# EAGLE design HB-power_v1.1 (EAGLE 9.4.2)
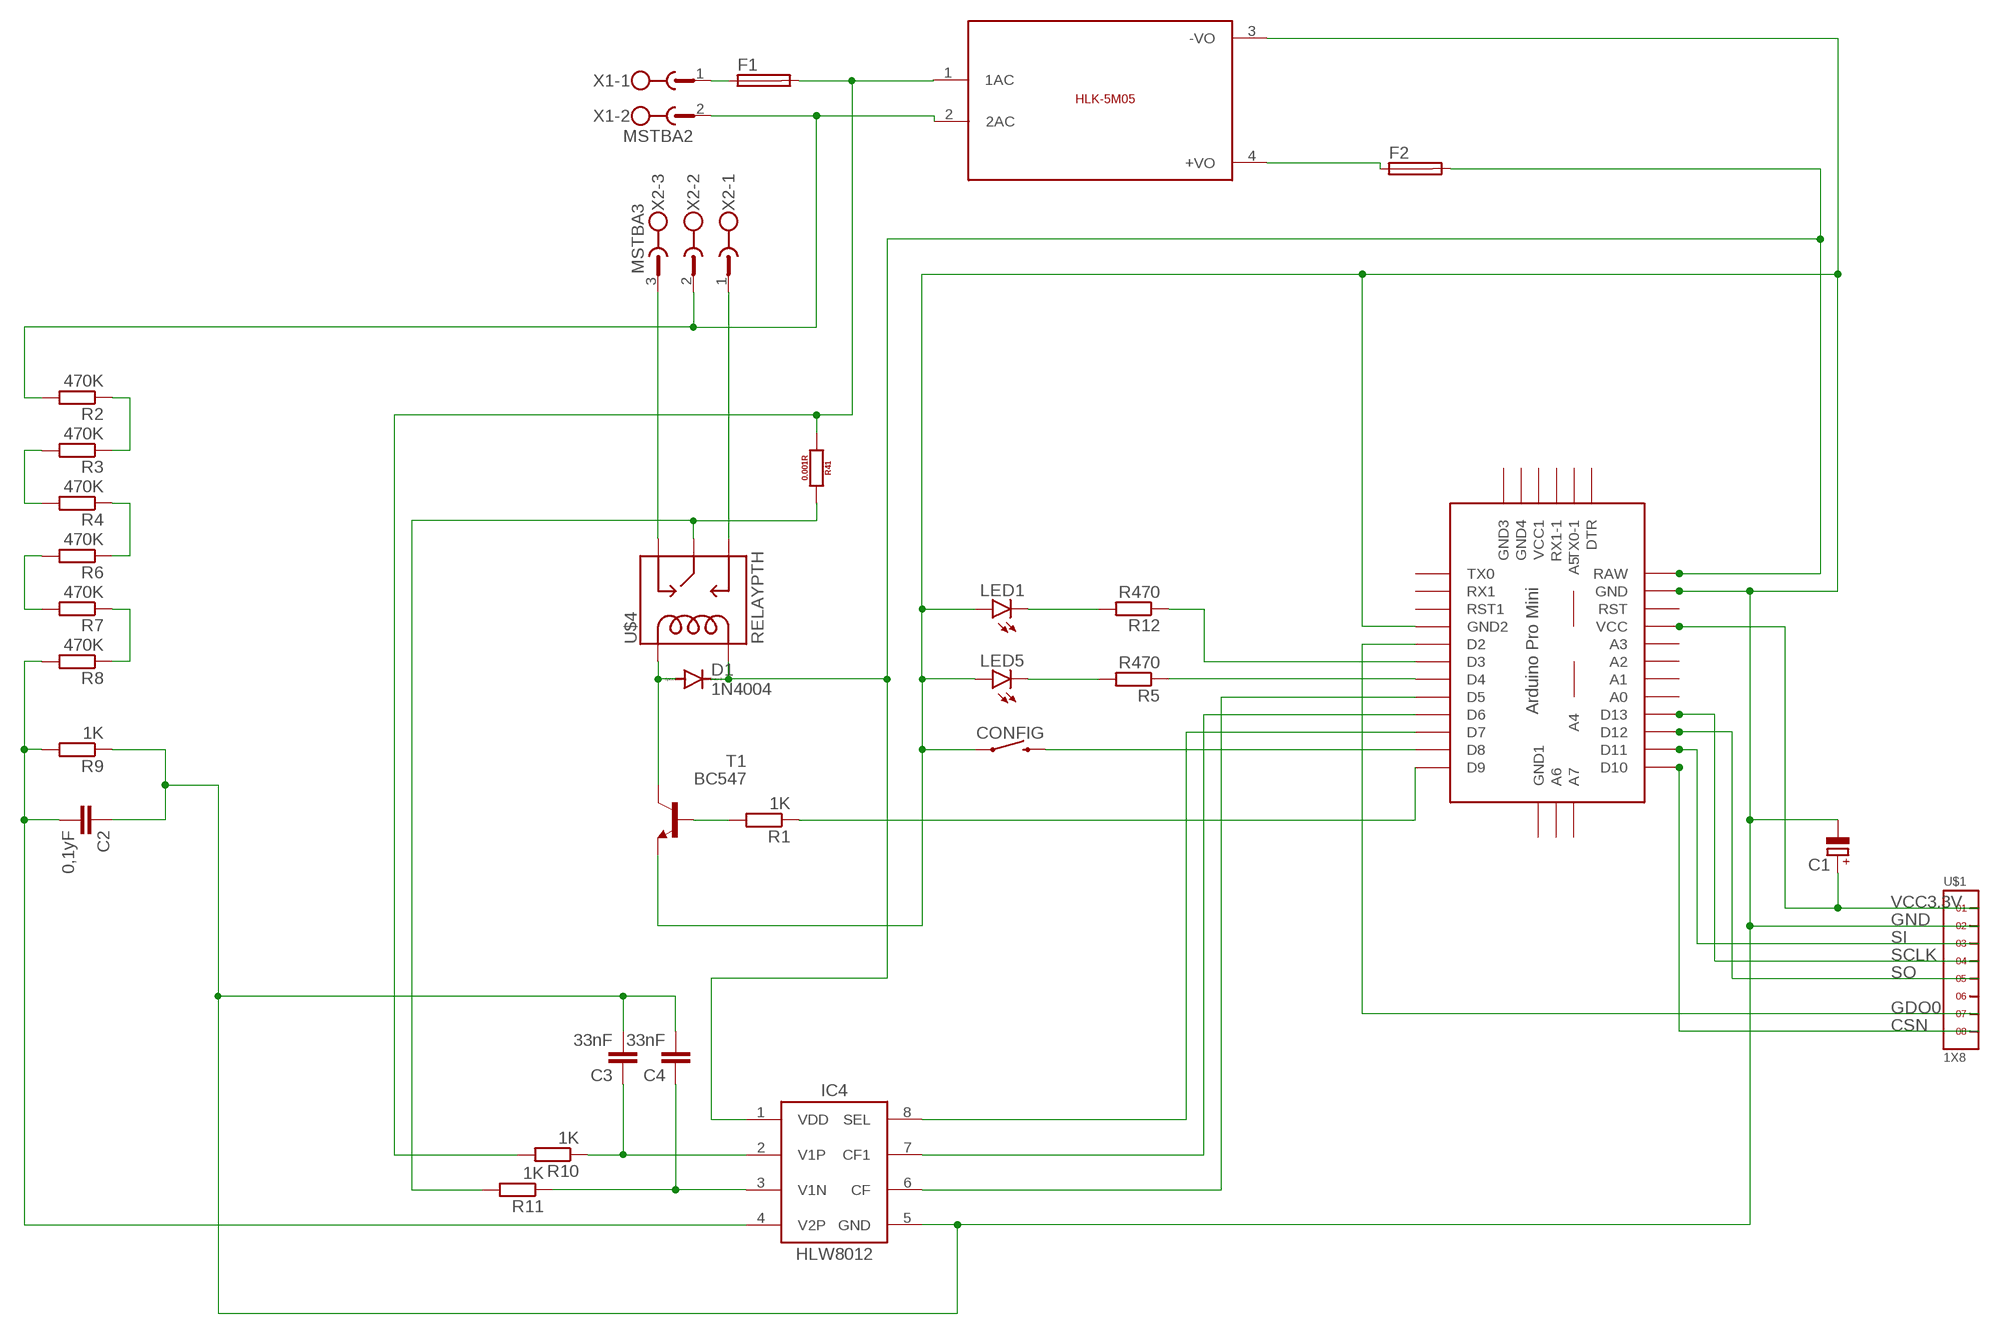
[diagram p0: schematic, sheet 1]

## Parts
C1  CPOL-EUE2.5-5  [E2,5-5]
C2  0,1yF  C-EU050-024X044  [C050-024X044]
C3  33nF  C-EU050-024X044  [C050-024X044]
C4  33nF  C-EU050-024X044  [C050-024X044]
CONFIG  MOMENTARY-SWITCH-SPST-PTH-6.0MM-KIT  [TACTILE_SWITCH_PTH_6.0MM_KIT]
D1  1N4004  [DO41-10]
F1  SH22,5A  [SH22,5A]
F2  SH22,5A  [SH22,5A]
IC4  HLW8012  [SOP8]
LED1  LED3MM  [LED3MM]
LED5  LED3MM  [LED3MM]
R1  1K  R-EU_0309/10  [0309/10]
R2  470K  R-EU_0309/10  [0309/10]
R3  470K  R-EU_0309/10  [0309/10]
R4  470K  R-EU_0309/10  [0309/10]
R5  R470  R-EU_0309/10  [0309/10]
R6  470K  R-EU_0309/10  [0309/10]
R7  470K  R-EU_0309/10  [0309/10]
R8  470K  R-EU_0309/10  [0309/10]
R9  1K  R-EU_0309/10  [0309/10]
R10  1K  R-EU_0309/10  [0309/10]
R11  1K  R-EU_0309/10  [0309/10]
R12  R470  R-EU_0309/10  [0309/10]
R41  0.001R  RESISTOR2512  [2512]
T1  BC547  [TO92]
U$1  1X8  [1X8]
U$2  ABK-PRO-MINI  [ABK-PRO-MINI]
U$3  5VDC/5W  HLK-5M05  [HLK-5M05]
U$4  RELAYPTH  [SRD-05VDC-SL-C]
X1  MSTBA2  [MSTBA2]
X2  MSTBA3  [MSTBA3]

## Nets
CSN: U$1.8 U$2.D10
GDO0: U$1.7 U$2.D2
GND: C1.- C2.1 C3.2 C4.2 CONFIG.1 IC4.5(GND) LED1.A LED5.A R9.1 T1.1(E) U$1.2 U$2.GND U$2.GND1(GND2) U$3.3(-VO)
L: F1.1 X1.1
L1: F1.2 R10.2 R41.1 U$3.1(1AC)
L2: R11.2 R41.2 U$4.SWCOMMON
N: R2.2 U$3.2(2AC) X1.2 X2.2
N$1: D1.A T1.3(C) U$4.COIL1
N$2: R1.2 T1.2(B)
N$3: LED1.K(C) R12.2
N$4: R1.1 U$2.D9
N$5: R12.1 U$2.D3
N$6: IC4.8(SEL) U$2.D7
N$7: IC4.7(CF1) U$2.D6
N$8: IC4.6(CF) U$2.D5
N$10: F2.1 U$3.4(+VO)
N$11: U$4.SWCLOSED(SWCLOSE) X2.3
N$12: U$4.SWOPEN X2.1
N$13: R2.1 R3.1
N$14: R4.1 R6.1
N$15: R7.1 R8.1
N$16: CONFIG.3 U$2.D8
N$17: R5.1 U$2.D4
N$18: LED5.K(C) R5.2
N$19: R3.2 R4.2
N$20: R6.2 R7.2
N$21: C2.2 IC4.4(V2P) R8.2 R9.2
N$23: C3.1 IC4.2(V1P) R10.1
N$25: C4.1 IC4.3(V1N) R11.1
SCLK: U$1.4 U$2.D13
SI: U$1.3 U$2.D11
SO: U$1.5 U$2.D12
VCC3.3V: C1.+ U$1.1 U$2.VCC
VCC5V: D1.C F2.2 IC4.1(VDD) U$2.RAW U$4.COIL0
Unconnected: U$1.6 U$2.A0 U$2.A1 U$2.A2 U$2.A3 U$2.A4 U$2.A5 U$2.A6 U$2.A7 U$2.DTR U$2.GND2(GND3) U$2.GND3(GND4) U$2.GND4(GND1) U$2.RST U$2.RST1 U$2.RX1 U$2.RX1-1 U$2.TX0 U$2.TX0-1 U$2.VCC1

## Library data of the parts
C1 = resistor:CPOL-EU: POLARIZED CAPACITOR, European symbol
C2-C4 = resistor:C-EU: CAPACITOR, European symbol
CONFIG = SparkFun-Switches:MOMENTARY-SWITCH-SPST: Momentary Switch (Pushbutton) - SPST Normally-open (NO) SPST momentary switches (buttons, pushbuttons). Variants PTH-12MM - 12mm square, through-hole Momentary Pushbutton Switch - 12mm Square <https://www.sparkfun.com/products/9190> (COM-09190) PTH-6.0MM, PTH-6.0MM-KIT - 6.0mm square, through-hole Mini Pushbutton Switch <https://www.sparkfun.com/products/97> (COM-00097) KIT package intended for soldering kit's - only one side of pads' copper is exposed. PTH-RIGHT-ANGLE-KIT - Right-angle, through-hole Right Angle Tactile Button <https://www.sparkfun.com/products/10791> - Used on SparkFun BigTime Watch Kit <https://www.sparkfun.com/products/11734> SMD-12MM - 12mm square, surface-mount Tactile Button - SMD (12mm) <https://www.sparkfun.com/products/12993> (COM-12993) Used on SparkFun PicoBoard <https://www.sparkfun.com/products/11888> SMD-4.5MM - 4.5mm Square Trackball Switch Used on SparkFun Blackberry Trackballer Breakout <https://www.sparkfun.com/products/13169> SMD-4.6MMX2.8MM - 4.60mm x 2.80mm, surface mount Used on SparkFun SAMD21 Mini Breakout <https://www.sparkfun.com/products/13664> SMD-5.2MM, SMD-5.2-REDUNDANT - 5.2mm square, surface-mount Mini Pushbutton Switch - SMD <https://www.sparkfun.com/products/8720> (COM-08720) Used on Arduino Pro Mini <https://www.sparkfun.com/products/11114> REDUNDANT package connects both switch circuits together SMD-6.0X3.5MM - 6.0 x 3.5mm, surface mount Momentary Reset Switch SMD <https://www.sparkfun.com/products/8229> (COM-08229) SMD-6.2MM-TALL - 6.2mm square, surface mount Tactile Button - SMD (6mm) <https://www.sparkfun.com/products/12992> Used on SparkFun Digital Sandbox <https://www.sparkfun.com/products/12651> SMD-RIGHT-ANGLE - Right-angle, surface mount Used on SparkFun Block for Intel® Edison - Arduino <https://www.sparkfun.com/products/13036>; PROD_ID: SWCH-08441; SF_SKU: COM-00097
D1 = diode:1N4004: DIODE general purpose rectifier, 1 A
F1 F2 = fuse:SH22,5A: FUSE HOLDER grid 22,5mm, isolated cap OGN0031 8201, Schurter (Buerklin); MPN: 0031.7701.11; OC_FARNELL: unknown; OC_NEWARK: 04F1224
IC4 = xose:HLW8012
LED1 LED5 = led:LED: LED OSRAM: - CHIPLED LG R971, LG N971, LY N971, LG Q971, LY Q971, LO R971, LY R971 LH N974, LH R974 LS Q976, LO Q976, LY Q976 LO Q996 - Hyper CHIPLED LW Q18S LB Q993, LB Q99A, LB R99A - SideLED LS A670, LO A670, LY A670, LG A670, LP A670 LB A673, LV A673, LT A673, LW A673 LH A674 LY A675 LS A676, LA A676, LO A676, LY A676, LW A676 LS A679, LY A679, LG A679 - Hyper Micro SIDELED® LS Y876, LA Y876, LO Y876, LY Y876 LT Y87S - SmartLED LW L88C, LW L88S LB L89C, LB L89S, LG L890 LS L89K, LO L89K, LY L89K LS L896, LA L896, LO L896, LY L896 - TOPLED LS T670, LO T670, LY T670, LG T670, LP T670 LSG T670, LSP T670, LSY T670, LOP T670, LYG T670 LG T671, LOG T671, LSG T671 LB T673, LV T673, LT T673, LW T673 LH T674 LS T676, LA T676, LO T676, LY T676, LB T676, LH T676, LSB T676, LW T676 LB T67C, LV T67C, LT T67C, LS T67K, LO T67K, LY T67K, LW E67C LS E67B, LA E67B, LO E67B, LY E67B, LB E67C, LV E67C, LT E67C LW T67C LS T679, LY T679, LG T679 LS T770, LO T770, LY T770, LG T770, LP T770 LB T773, LV T773, LT T773, LW T773 LH T774 LS E675, LA E675, LY E675, LS T675 LS T776, LA T776, LO T776, LY T776, LB T776 LHGB T686 LT T68C, LB T68C - Hyper Mini TOPLED® LB M676 - Mini TOPLED Santana® LG M470 LS M47K, LO M47K, LY M47K Source: http://www.osram.convergy.de LUXEON: - LUMILED® LXK2-PW12-R00, LXK2-PW12-S00, LXK2-PW14-U00, LXK2-PW14-V00 LXK2-PM12-R00, LXK2-PM12-S00, LXK2-PM14-U00 LXK2-PE12-Q00, LXK2-PE12-R00, LXK2-PE12-S00, LXK2-PE14-T00, LXK2-PE14-U00 LXK2-PB12-K00, LXK2-PB12-L00, LXK2-PB12-M00, LXK2-PB14-N00, LXK2-PB14-P00, LXK2-PB14-Q00 LXK2-PR12-L00, LXK2-PR12-M00, LXK2-PR14-Q00, LXK2-PR14-R00 LXK2-PD12-Q00, LXK2-PD12-R00, LXK2-PD12-S00 LXK2-PH12-R00, LXK2-PH12-S00 LXK2-PL12-P00, LXK2-PL12-Q00, LXK2-PL12-R00 Source: www.luxeon.com KINGBRIGHT: KA-3528ASYC Source: www.kingbright.com
R1-R12 = resistor:R-EU_: RESISTOR, European symbol
R41 = xose:RESISTOR: Generic EU resistor symbol
T1 = transistor:BC547: NPN TRANSISTOR
U$1 = headers(2mm):1X8
U$2 = Arduino-clone:ABK-PRO-MINI: ABK Pro-Mini Arduino Clone
U$3 = HLK-5M05:HLK-5M05: HLK-5M05 is an 5Volt/5W smps developed by HI-LINK; SIZE: 23x38(mm)
U$4 = SRD-05VDC-SL-C:RELAY: SPDT relay (COM-00101)
X1 = con-phoenix-508:MSTBA2: PHOENIX; MF: FARNELL; MPN: 1757242; OC_FARNELL: 3705171; OC_NEWARK: 71C4161
X2 = con-phoenix-508:MSTBA3: PHOENIX; MF: FARNELL; MPN: 1757255; OC_FARNELL: 3705183; OC_NEWARK: 71C4162

## Board
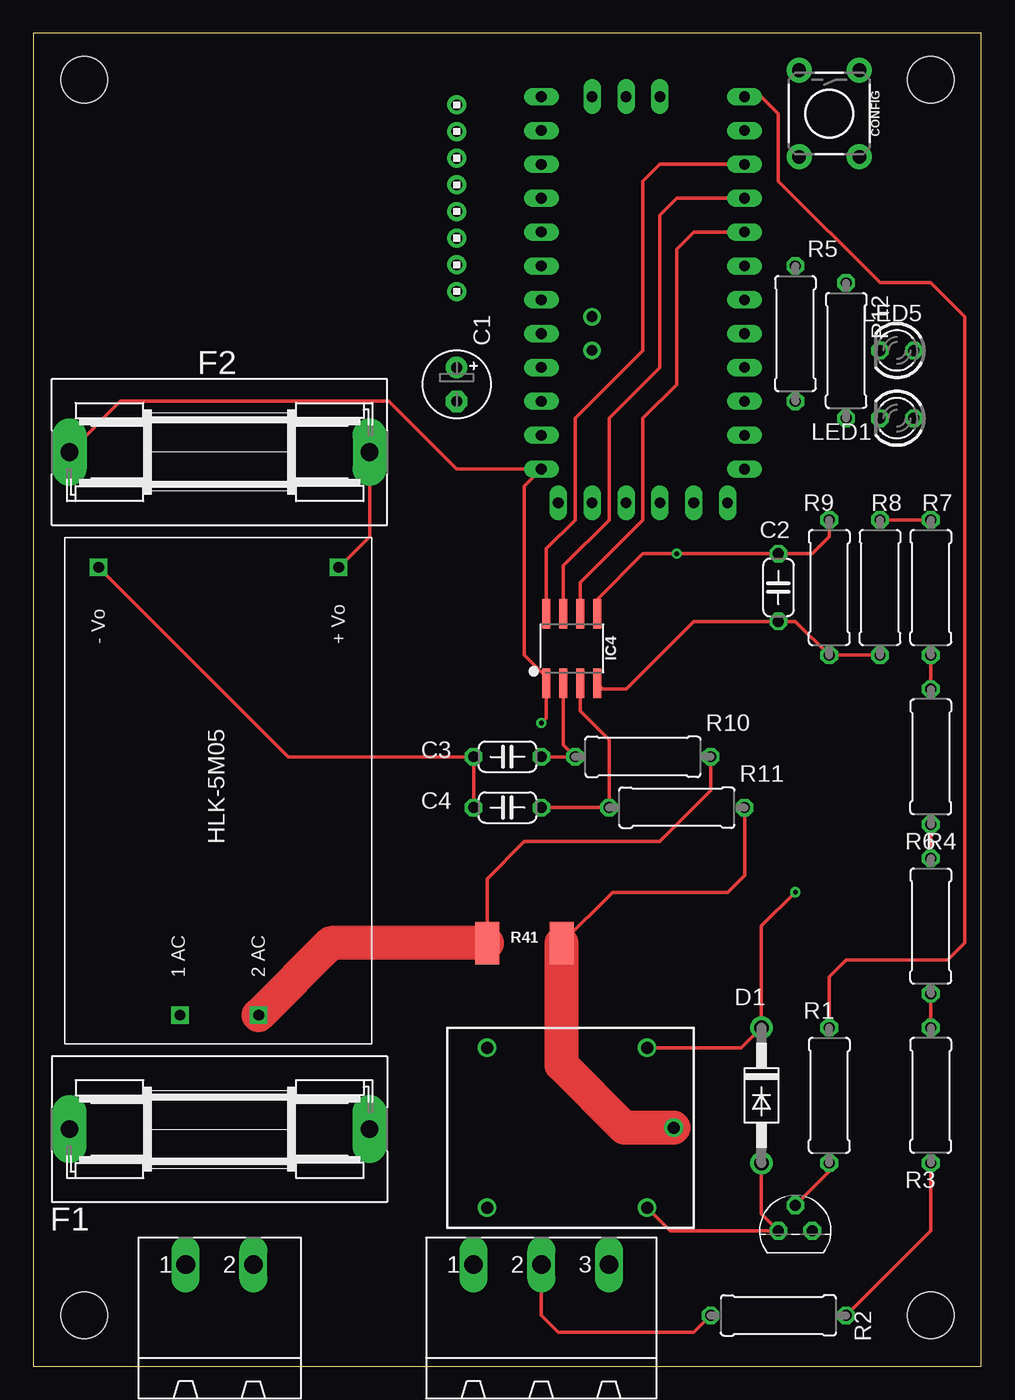
[diagram p1: board, top side]
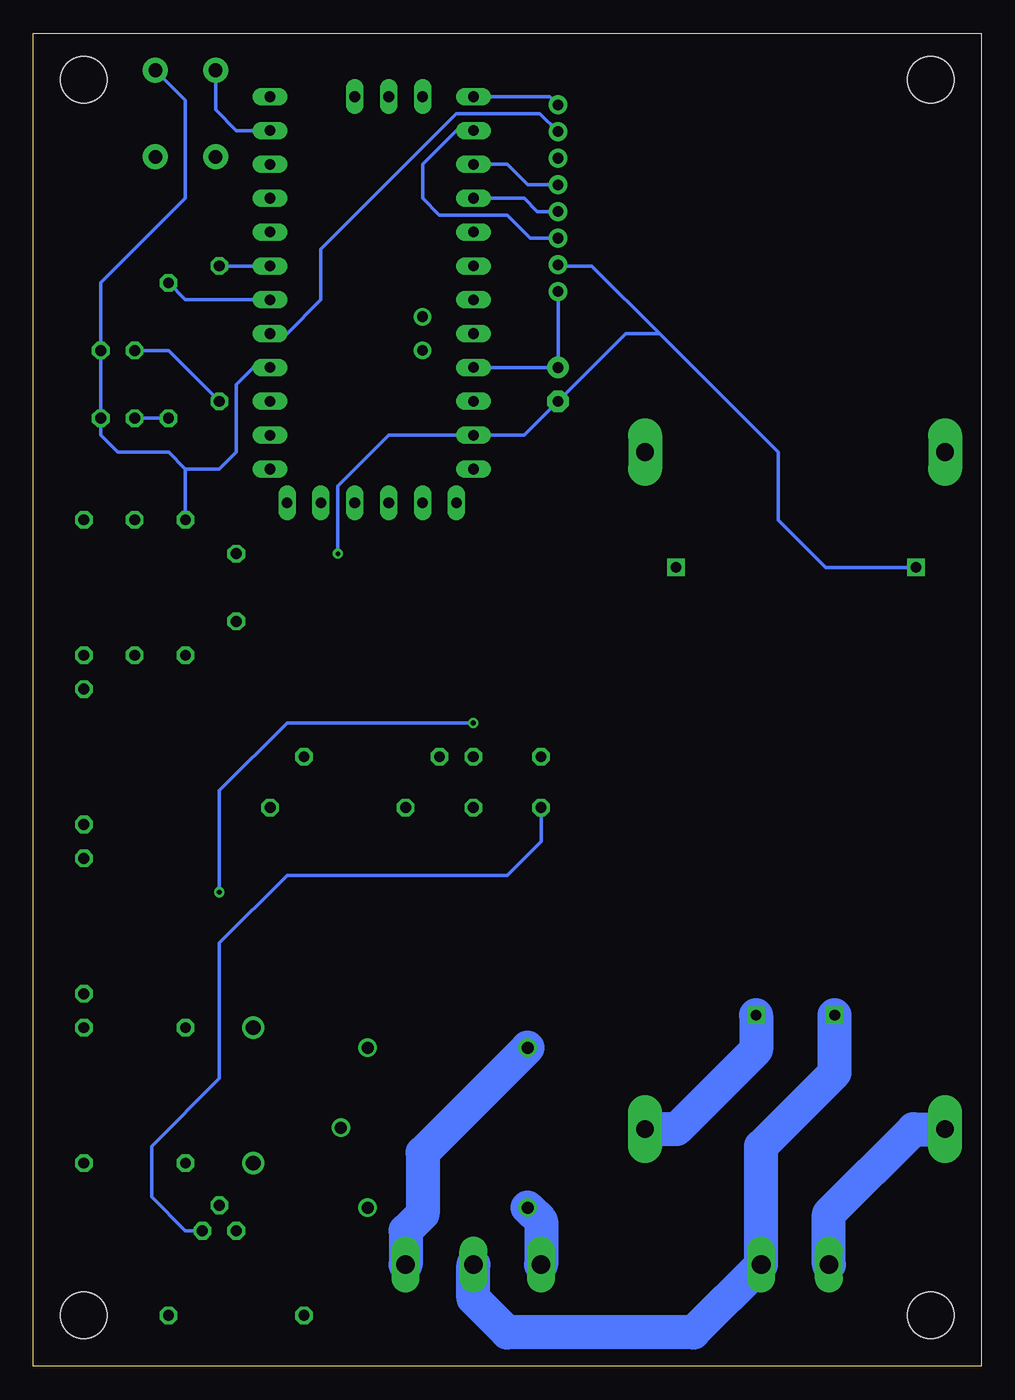
[diagram p2: board, bottom side, seen from below]

Size 71.1 x 100 mm. Coordinates in mm from the lower left corner, seen from the top.
Outline: 0,0 71.1,0 71.1,100 0,100 0,0
Copper layers (1*16): Top 0.035mm / dielectric 1.5mm / Bottom 0.035mm
Design rules "default": minimum track width 6mil, minimum drill 0.35mm, track to track 6mil, track to pad 6mil, pad to pad 6mil, via to via 6mil, smd to smd 6mil, copper to edge 40mil, drill to drill 6mil, minimum pad ring 10mil, minimum via ring 8mil, stop-mask expansion 4mil, vias tented up to drill 0mil, thermal gap 10mil
Holes 3.5 mm at 67.31,96.52 3.81,96.52 3.81,3.81 67.31,3.81

### Footprints (pad centres in the part's own frame; a part is rotated, then mirrored left to right if it is on the bottom)
E2,5-5 = drill 0.813 pad 1.6: + -1.27,0 | drill 0.813 pad 1.6 octagon: - 1.27,0
C050-024X044 = drill 0.813 octagon: 1 -2.54,0; 2 2.54,0
TACTILE_SWITCH_PTH_6.0MM_KIT = drill 1.016 pad 1.88: 1 -3.251,2.261; 2 3.251,2.261; 3 -3.251,-2.261; 4 3.251,-2.261
DO41-10 = drill 1.118: A 5.08,0; C -5.08,0
SH22,5A = drill 1.321 pad 2.54 long: 1 -11.252,0; 2 11.252,0
SOP8 = smd 0.61 x 2.21: 1 0.381,-0.838; 2 1.651,-0.838; 3 2.921,-0.838; 4 4.191,-0.838; 5 4.191,4.394; 6 2.921,4.394; 7 1.651,4.394; 8 0.381,4.394
LED3MM = drill 0.813 octagon: A -1.27,0; K 1.27,0
0309/10 = drill 0.813 octagon: 1 -5.08,0; 2 5.08,0
2512 = smd 1.8 x 3.2: 1 -2.8,0; 2 2.8,0
TO92 = drill 0.813 octagon: 1 1.27,0; 2 0,1.905; 3 -1.27,0
1X8 = drill 0.8 pad 1.422: 1 -7,0; 2 -5,0; 3 -3,0; 4 -1,0; 5 1,0; 6 3,0; 7 5,0; 8 7,0
ABK-PRO-MINI = drill 0.8 long: A0 10.16,-3.81; A1 10.16,-6.35; A2 10.16,-8.89; A3 10.16,-11.43; A6 3.81,-21.59; A7 6.35,-21.59; D2 -5.08,-3.81; D3 -5.08,-6.35; D4 -5.08,-8.89; D5 -5.08,-11.43; D6 -5.08,-13.97; D7 -5.08,-16.51; D8 -5.08,-19.05; D9 -5.08,-21.59; D10 10.16,-21.59; D11 10.16,-19.05; D12 10.16,-16.51; D13 10.16,-13.97; DTR 8.89,8.89; GND 10.16,3.81; GND1 -5.08,-1.27; GND2 -3.81,8.89; GND3 -1.27,8.89; GND4 1.27,-21.59; RAW 10.16,6.35; RST 10.16,1.27; RST1 -5.08,1.27; RX1 -5.08,3.81; RX1-1 3.81,8.89; TX0 -5.08,6.35; TX0-1 6.35,8.89; VCC 10.16,-1.27; VCC1 1.27,8.89 | drill 0.8: A4 6.35,-5.08; A5 6.35,-2.54
HLK-5M05 = drill 0.8 square: 1 -16.85,-2.93; 2 -16.85,2.97; 3 16.75,9.07; 4 16.75,-8.93
SRD-05VDC-SL-C = drill 0.9: COIL0 -5.39,-6.12; COIL1 -5.39,5.88; SWCLOSED 6.61,-6.12; SWCOMMON -7.39,-0.12; SWOPEN 6.61,5.88
MSTBA2 = drill 1.397 long: 1 -2.54,5.08; 2 2.54,5.08
MSTBA3 = drill 1.397 long: 1 -5.08,5.08; 2 0,5.08; 3 5.08,5.08

### Placement (x,y rotation side)
C1  31.75,73.66 270 top
C2  55.88,58.42 270 top
C3  35.56,45.72 180 top
C4  35.56,41.91 180 top
CONFIG  59.69,93.98 270 top
D1  54.61,20.32 270 top
F1  13.97,17.78 0 top
F2  13.97,68.58 180 top
IC4  38.1,52.07 0 top
LED1  64.77,71.12 180 top
LED5  64.77,76.2 180 top
R1  59.69,20.32 270 top
R2  55.88,3.81 180 top
R3  67.31,20.32 90 top
R4  67.31,33.02 270 top
R5  57.15,77.47 270 top
R6  67.31,45.72 90 top
R7  67.31,58.42 270 top
R8  63.5,58.42 270 top
R9  59.69,58.42 270 top
R10  45.72,45.72 0 top
R11  48.26,41.91 0 top
R12  60.96,76.2 270 top
R41  36.83,31.75 0 top
T1  57.15,10.16 0 top
U$1  31.75,87.63 90 top
U$2  48.26,73.66 180 top
U$3  13.97,43.18 90 top
U$4  40.64,17.78 180 top
X1  13.97,2.54 0 top
X2  38.1,2.54 0 top

### Tracks (layer width: path | path; a pad name or v marks a point on that pad's centre or on a via)
CSN
  Bottom 0.254: U$1.8 32.37,95.25 U$2.D10
GDO0
  Bottom 0.254: U$1.7 33.1,93.98 39.37,93.98 49.53,83.82 49.53,80.01 52.07,77.47 U$2.D2
GND  (via drill 0.35)
  Top 0.254: IC4.5 42.29,57.53 45.72,60.96 v48.26,60.96 C2.1 58.42,60.96 59.69,62.23 R9.1 | U$3.3 19.11,45.72 C3.2 C4.2
  Bottom 0.254: C4.2 33.02,39.37 35.56,36.83 52.07,36.83 57.15,31.75 57.15,21.59 62.23,16.51 62.23,12.7 59.69,10.16 T1.1 | R9.1 59.69,67.31 | 59.69,67.31 60.96,68.58 64.77,68.58 66.04,69.85 LED1.A LED5.A 66.04,81.28 59.69,87.63 59.69,94.97 CONFIG.1 | U$1.2 31.67,82.55 29.21,82.55 24.13,77.47 | U$3.3 11.67,59.93 15.24,63.5 15.24,68.58 24.13,77.47 | 24.13,77.47 26.67,77.47 C1.- 34.29,69.85 U$2.GND 44.45,69.85 48.26,66.04 v48.26,60.96 | U$2.GND1 54.61,74.93 55.88,73.66 55.88,68.58 57.15,67.31 59.69,67.31
L
  Bottom 2.54: X1.1 11.43,11.43 5.08,17.78 F1.1
L1
  Top 0.254: R41.1 34.03,36.57 36.83,39.37 46.99,39.37 50.8,43.18 R10.2
  Top 2.54: U$3.1 22.32,31.75 R41.1
  Bottom 2.54: U$3.1 16.9,23.74 22.86,17.78 F1.2
L2
  Top 0.254: R41.2 43.44,35.56 52.07,35.56 53.34,36.83 R11.2
  Top 2.54: U$4.SWCOMMON 44.33,17.9 39.63,22.6 R41.2
N
  Top 0.254: X2.2 38.1,3.81 39.37,2.54 49.53,2.54 R2.2
  Bottom 2.54: U$3.2 11,22.02 16.51,16.51 X1.2 21.59,2.54 35.56,2.54 38.1,5.08 X2.2
N$1
  Top 0.254: U$4.COIL1 47.77,10.16 T1.3 54.61,11.43 D1.A
N$2
  Top 0.254: T1.2 59.69,14.61 R1.2
N$3
  Bottom 0.254: R12.2 LED1.K
N$4
  Top 0.254: R1.1 59.69,29.21 60.96,30.48 68.58,30.48 69.85,31.75 69.85,78.74 67.31,81.28 63.5,81.28 55.88,88.9 55.88,93.98 54.61,95.25 U$2.D9
N$5
  Bottom 0.254: U$2.D3 59.69,80.01 R12.1
N$6
  Top 0.254: IC4.8 38.48,61.34 40.64,63.5 40.64,71.12 45.72,76.2 45.72,88.9 46.99,90.17 U$2.D7
N$7
  Top 0.254: IC4.7 39.75,60.07 43.18,63.5 43.18,71.12 46.99,74.93 46.99,86.36 48.26,87.63 U$2.D6
N$8
  Top 0.254: IC4.6 41.02,58.8 45.72,63.5 45.72,71.12 48.26,73.66 48.26,83.82 49.53,85.09 U$2.D5
N$10
  Top 0.254: U$3.4 25.22,62.25 F2.1
N$11
  Bottom 2.54: U$4.SWCLOSED 41.91,16.02 41.91,11.43 43.18,10.16 X2.3
N$12
  Bottom 2.54: U$4.SWOPEN 33.02,10.89 X2.1
N$13
  Top 0.254: R2.1 67.31,10.16 R3.1
N$14
  Top 0.254: R6.1 R4.1
N$15
  Top 0.254: R8.1 R7.1
N$16
  Bottom 0.254: U$2.D8 55.88,92.71 57.43,94.26 CONFIG.3
N$17
  Bottom 0.254: U$2.D4 R5.1
N$18
  Bottom 0.254: LED5.K 60.96,76.2 R5.2
N$19
  Top 0.254: R3.2 R4.2
N$20
  Top 0.254: R7.2 R6.2
N$21
  Top 0.254: R8.2 R9.2 57.15,55.88 C2.2 49.53,55.88 44.45,50.8 42.72,50.8 IC4.4
N$23
  Top 0.254: C3.1 R10.1 39.75,46.61 IC4.2
N$25
  Top 0.254: C4.1 R11.1 43.18,46.99 41.02,49.15 IC4.3
SCLK
  Bottom 0.254: U$1.4 33.29,86.63 34.29,87.63 U$2.D13
SI
  Bottom 0.254: U$1.3 33.83,84.63 35.56,86.36 40.64,86.36 41.91,87.63 41.91,90.17 39.37,92.71 U$2.D11
SO
  Bottom 0.254: U$1.5 34.02,88.63 35.56,90.17 U$2.D12
VCC3.3V
  Bottom 0.254: U$1.1 C1.+ U$2.VCC
VCC5V  (via drill 0.35)
  Top 0.254: U$4.COIL0 53.11,23.9 D1.C 54.61,33.02 v57.15,35.56 | F2.2 6.53,72.39 26.67,72.39 31.75,67.31 U$2.RAW 36.83,66.04 36.83,53.34 38.48,51.69 IC4.1 38.48,48.64 v38.1,48.26
  Bottom 0.254: v38.1,48.26 52.07,48.26 57.15,43.18 v57.15,35.56